# Altium schematic sheet 03_Periphs.SchDoc
size A; SheetNumber: 3; SheetTotal: 3
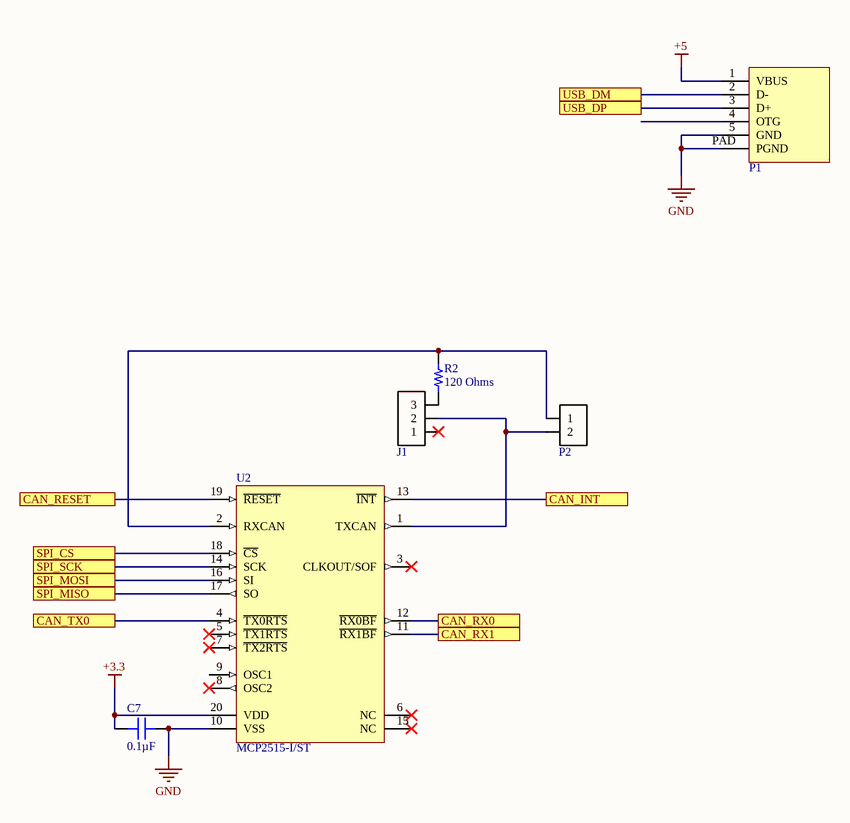
[diagram p0: 03_Periphs.SchDoc]

## Parts
C7  0.1µF  [CAP 0805_2012]
J1  conn-3x1_0  [HDDR_3x1_0]  (value not drawn)
P1  usb_micro_b  [10118192]  (value not drawn)
P2  conn-2x1_0  [TERM_3.50MM_2x1_0]  (value not drawn)
R2  120 Ohms  [RES 0805_2012]
U2  MCP2515-I/ST  [TSSOP-ST20_N]

## Ports
CAN_INT, CAN_RESET, CAN_RX0, CAN_RX1, CAN_TX0, SPI_CS, SPI_MISO, SPI_MOSI, SPI_SCK, USB_DM, USB_DP

## Nets
+3.3: C7.2 U2.20(VDD)
+5: P1.1(VBUS)
GND: C7.1 P1.5(GND) P1.PAD(PGND) U2.10(VSS)
CAN_INT: U2.13(~{INT}) ; port CAN_INT
CAN_RESET: U2.19(~{RESET}) ; port CAN_RESET
CAN_RX0: U2.12(~{RX0BF}) ; port CAN_RX0
CAN_RX1: U2.11(~{RX1BF}) ; port CAN_RX1
CAN_TX0: U2.4(~{TX0RTS}) ; port CAN_TX0
SPI_CS: U2.18(~{CS}) ; port SPI_CS
SPI_MISO: U2.17(SO) ; port SPI_MISO
SPI_MOSI: U2.16(SI) ; port SPI_MOSI
SPI_SCK: U2.14(SCK) ; port SPI_SCK
USB_DM: P1.2(D-) ; port USB_DM
USB_DP: P1.3(D+) ; port USB_DP
NetJ1_2: J1.2 P2.2 U2.1(TXCAN)
NetJ1_3: J1.3 R2.1
NetP2_1: P2.1 R2.2 U2.2(RXCAN)

Not connected (* = marked no-connect by the designer): J1 1*; P1 4(OTG); U2 3(CLKOUT/SOF)* 5(~{TX1RTS})* 6(NC)* 7(~{TX2RTS})* 8(OSC2)* 9(OSC1) 15(NC)*

## Library data of the parts
C7 = C0805X104K5RAC3316: CAP CER 0805 0.1UF 50V X7R; Manufacturer: KEMET; Tolerance: ±10%; Part Number: C0805X104K5RAC3316; Value: 0.1µF; Applications: Automotive, Boardflex Sensitive; Capacitance: 0.1µF; ComponentLink1Description: Datasheet; ComponentLink1URL: https://api.kemet.com/component-edge/download/datasheet/C0805X104K5RAC3316.pdf; ComponentLink2Description: DigiKey Link; ComponentLink2URL: http://digikey.com/product-detail/en/kemet/C0805X104K5RAC3316/399-C0805X104K5RAC3316CT-ND/10315823; Device Package: 0805 (2012 Metric); Features: Soft Termination; LastUpdated: 9/2/2020 1:04:41 AM; Lifecycle Status: Active; Minimum Order: 1; Mounting Type: Surface Mount, MLCC; Operating Temperature: -55°C ~ 125°C; Package / Case: 0805 (2012 Metric); Packaging: TapeAndReel; PartId: 2769; Part Status: Active; Price: 0.08; Ratings: AEC-Q200; Series: SMD Auto X7R VW80808; Size / Dimension: 0.079" L x 0.049" W (2.00mm x 1.25mm); Supplier 1: DigiKey; Supplier Part Number 1: 399-C0805X104K5RAC3316CT-ND; Temperature Coefficient: X7R; Thickness (Max): 0.047" (1.20mm); Voltage - Rated: 50V
J1 = CONN-00037: Header, 3x1, 0.1"; Positions per level: 3; Levels: 1; Part Number: CONN-00037; Type: Header
P1 = CONN-00011: USB Micro B Type Receptacle; Manufacturer: Amphenol; Positions per level: 5; Levels: 1; Current: 1.8; Part Number: CONN-00011; Type: USB Micro B; Manufacturer PN: 10118192
P2 = CONN-00023: Term Blk, 2 Pos, 8A, 3.5mm Pitch, Screwless; Manufacturer: Phoenix Contact; Manufacturer PN: 1861933; Positions per level: 2; Levels: 1; Current: 8; Part Number: CONN-00023; Type: Terminal Block; Cost: 0.79; Weight: 1.13
R2 = CRGCQ0805F120R: CRGCQ 0805 120R 1%; Manufacturer: TE Connectivity Passive Product; Power (Watts): 0.125W, 1/8W; Temperature Coefficient: ±100ppm/°C; Part Number: CRGCQ0805F120R; Value: 120 Ohms; ComponentLink1Description: Datasheet; ComponentLink1URL: https://www.te.com/commerce/DocumentDelivery/DDEController?Action=srchrtrv&DocNm=1773204-3&DocType=DS&DocLang=English; ComponentLink2Description: DigiKey Link; ComponentLink2URL: http://digikey.com/product-detail/en/te-connectivity-passive-product/CRGCQ0805F120R/A129738CT-ND/8577570; Composition: Thick Film; Device Package: 0805 (2012 Metric); Features: Automotive AEC-Q200, Moisture Resistant; Height - Seated (Max): 0.026" (0.65mm); LastUpdated: 9/2/2020 1:14:36 AM; Lifecycle Status: Active; Minimum Order: 1; Number of Terminations: 2; Operating Temperature: -55°C ~ 155°C; Package / Case: 0805 (2012 Metric); Packaging: TapeAndReel; PartId: 47663; Part Status: Active; Price: 0.01; Ratings: AEC-Q200; Resistance: 120 Ohms; Series: CRGCQ; Size / Dimension: 0.079" L x 0.049" W (2.00mm x 1.25mm); Supplier 1: DigiKey; Supplier Part Number 1: A129738CT-ND; Supplier Device Package: 0805; Tolerance: ±1%
U2 = CMP-0186-00077-2: Stand-Alone CAN Controller With SPI Interface, 20-Pin TSSOP, Industrial Temperature; DatasheetVersion: revF, Oct-2010; ComponentLink1Description: Manufacturer URL; PackageDescription: 20-Lead Plastic Thin Shrink Small Outline (ST) - 4.4mm Body [TSSOP]; ComponentLink1URL: http://www.microchip.com/; RevisionNote: URLs added. DatasheetVersion updated.; PackageReference: TSSOP-ST20; Code_JEDEC: MO-153-AC; ComponentLink2Description: Datasheet; ComponentLink2URL: http://ww1.microchip.com/downloads/en/DeviceDoc/21801f.pdf; PackageVersion: revBB, Aug-2009; ComponentLink3URL: http://www.microchip.com/stellent/groups/techpub_sg/documents/packagingspec/en012702.pdf; ComponentLink3Description: Package Specification